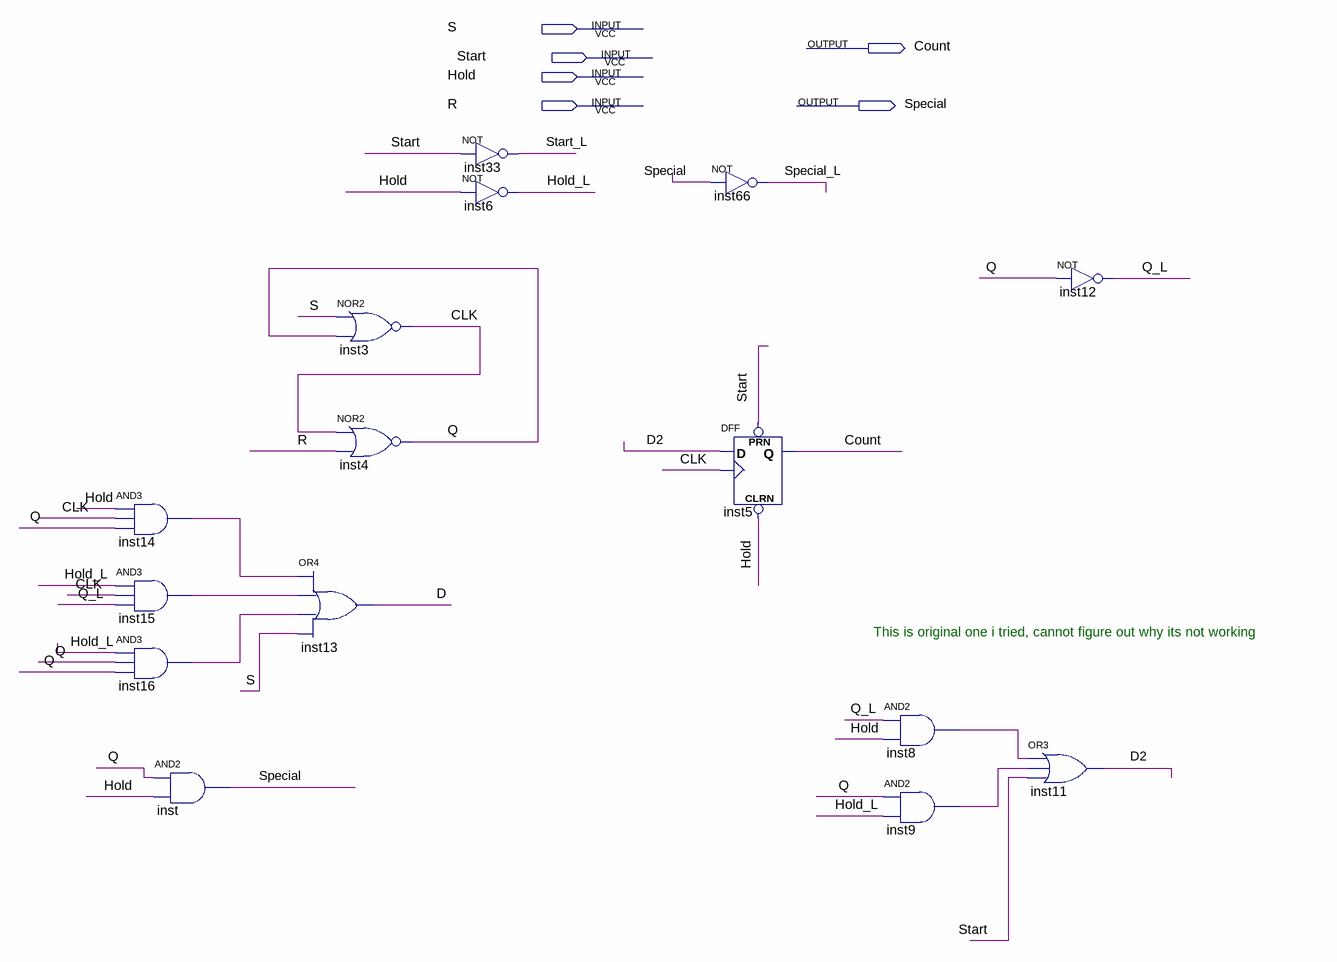
[diagram p0: schematic sheet]
// Quartus schematic Practical1.bdf as structural Verilog: 15 symbols, 6 pins
module Practical1 (
  input  S,
  input  Start,
  input  Hold,
  input  R,
  output Count,
  output Special
);

  wire CLK, D, D2, Hold_L, inst8_out, inst9_out, inst14_out, inst15_out, inst16_out, Q, Q_L, Special_L,
       Start_L;

  and inst14 (inst14_out, Hold, CLK, Q);
  and inst15 (inst15_out, Hold_L, CLK, Q_L);
  and inst16 (inst16_out, Hold_L, Q, Q);
  and inst (Special, Q, Hold);
  nor inst3 (CLK, S, Q);
  nor inst4 (Q, CLK, R);
  or inst13 (D, inst14_out, inst15_out, inst16_out, S);
  not inst33 (Start_L, Start);
  not inst6 (Hold_L, Hold);
  not inst66 (Special_L, Special);
  DFF inst5 (.CLRN(Hold), .CLK(CLK), .D(D2), .PRN(Start), .Q(Count));
  and inst8 (inst8_out, Q_L, Hold);
  and inst9 (inst9_out, Q, Hold_L);
  or inst11 (D2, inst8_out, inst9_out, Start);
  not inst12 (Q_L, Q);

  // Notes on the sheet:
  //   This is original one i tried, cannot figure out why its not working
endmodule
